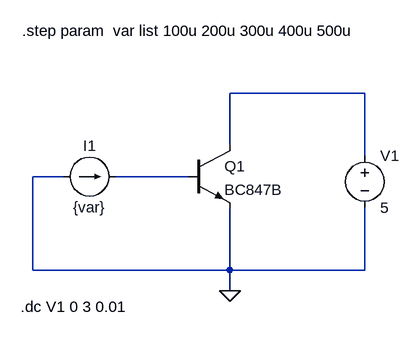
[diagram p0: schematic 1_Zadatak_Lab4.asc]
1_Zadatak_Lab4.asc, the LTspice schematic file:
Version 4
SHEET 1 880 680
WIRE 400 16 192 16
WIRE 192 96 192 16
WIRE 400 112 400 16
WIRE -64 144 -112 144
WIRE 128 144 16 144
WIRE -112 288 -112 144
WIRE 192 288 192 192
WIRE 192 288 -112 288
WIRE 400 288 400 192
WIRE 400 288 192 288
WIRE 192 320 192 288
FLAG 192 320 0
SYMBOL npn 128 96 R0
SYMATTR InstName Q1
SYMATTR Value BC847B
SYMBOL current -64 144 R270
WINDOW 0 32 40 VTop 2
WINDOW 3 -32 40 VBottom 2
SYMATTR InstName I1
SYMATTR Value {var}
SYMBOL voltage 400 96 R0
WINDOW 123 0 0 Left 0
WINDOW 39 0 0 Left 0
SYMATTR InstName V1
SYMATTR Value 5
TEXT -128 -80 Left 2 !.step param  var list 100u 200u 300u 400u 500u
TEXT -130 344 Left 2 !.dc V1 0 3 0.01

The netlist it stands for:
* 1_Zadatak_Lab4.asc
Q1 N001 N002 0 0 BC847B
I1 0 N002 {var}
V1 N001 0 5
.model NPN NPN
.model PNP PNP
.lib standard.bjt
.step param  var list 100u 200u 300u 400u 500u
.dc V1 0 3 0.01
.backanno
.end